# EAGLE design 21-de-77 (EAGLE 6.6.0)
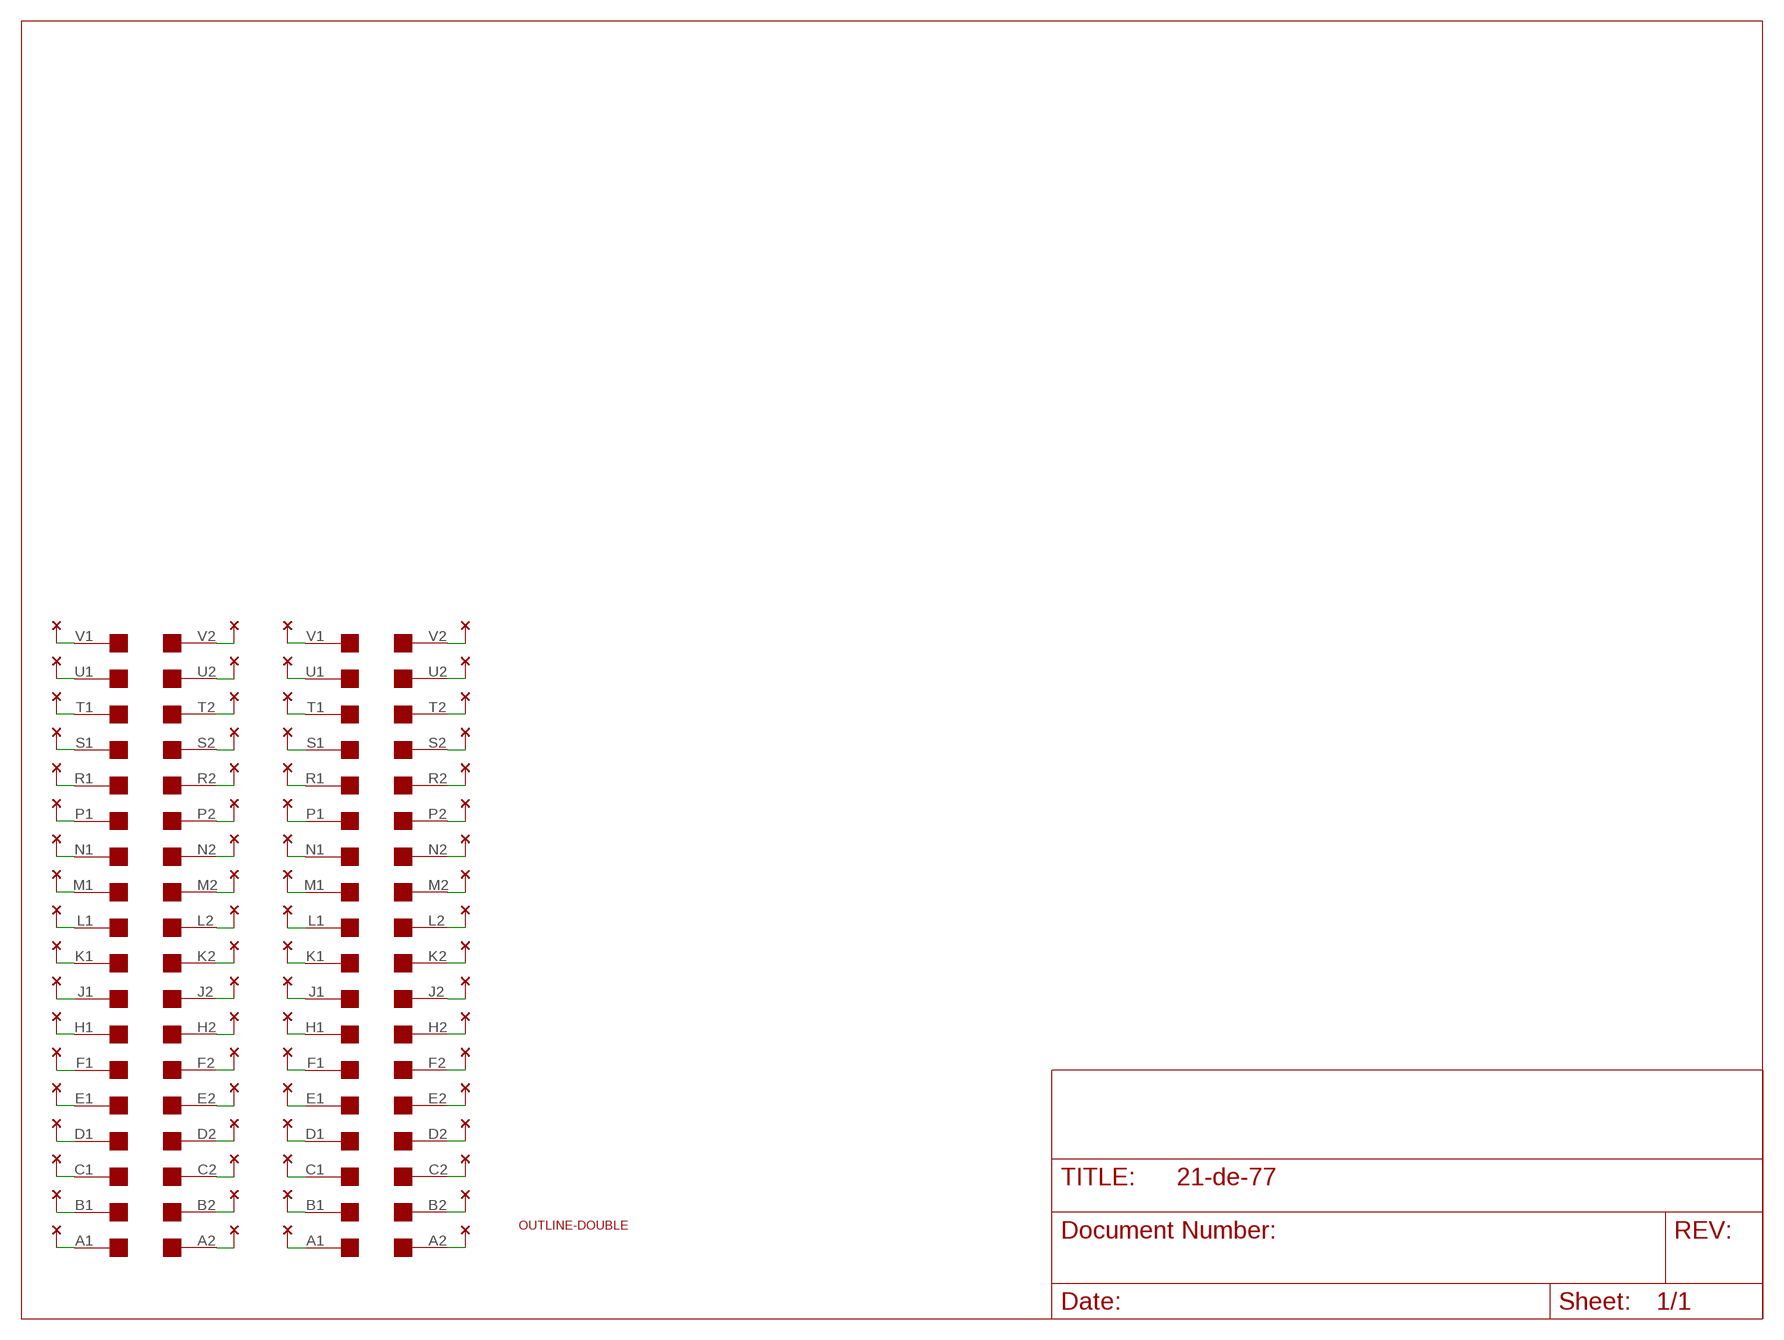
[diagram p0: schematic, sheet 1]

## Parts
U$1  SINGLE  [EDGE-CON2]
U$3  THRU-HOLE2C  [THRU-HOLEC]
U$4  OUTLINE-DOUBLE  [DOUBLE]
U$5  THRU-HOLE2C  [THRU-HOLEC]
U$6  SINGLE  [EDGE-CON2]

## Nets
N$1: U$1.L2 U$3.L2
N$2: U$1.M2 U$3.M2
N$3: U$1.N2 U$3.N2
N$4: U$1.K2 U$3.K2
N$5: U$1.J2 U$3.J2
N$6: U$1.H2 U$3.H2
N$7: U$1.F2 U$3.F2
N$8: U$1.P2 U$3.P2
N$9: U$1.R2 U$3.R2
N$10: U$1.S2 U$3.S2
N$11: U$1.T2 U$3.T2
N$12: U$1.E2 U$3.E2
N$13: U$1.D2 U$3.D2
N$14: U$1.U2 U$3.U2
N$15: U$1.V2 U$3.V2
N$16: U$1.C2 U$3.C2
N$17: U$1.B2 U$3.B2
N$18: U$1.A2 U$3.A2
N$19: U$1.V1 U$3.V1
N$20: U$1.A1 U$3.A1
N$21: U$1.B1 U$3.B1
N$22: U$1.C1 U$3.C1
N$23: U$1.D1 U$3.D1
N$24: U$1.E1 U$3.E1
N$25: U$1.F1 U$3.F1
N$26: U$1.H1 U$3.H1
N$27: U$1.J1 U$3.J1
N$28: U$1.K1 U$3.K1
N$29: U$1.L1 U$3.L1
N$30: U$1.M1 U$3.M1
N$31: U$1.N1 U$3.N1
N$32: U$1.P1 U$3.P1
N$33: U$1.R1 U$3.R1
N$34: U$1.S1 U$3.S1
N$35: U$1.T1 U$3.T1
N$36: U$1.U1 U$3.U1
N$37: U$5.L2 U$6.L2
N$38: U$5.M2 U$6.M2
N$39: U$5.N2 U$6.N2
N$40: U$5.K2 U$6.K2
N$41: U$5.J2 U$6.J2
N$42: U$5.H2 U$6.H2
N$43: U$5.F2 U$6.F2
N$44: U$5.P2 U$6.P2
N$45: U$5.R2 U$6.R2
N$46: U$5.S2 U$6.S2
N$47: U$5.T2 U$6.T2
N$48: U$5.E2 U$6.E2
N$49: U$5.D2 U$6.D2
N$50: U$5.U2 U$6.U2
N$51: U$5.V2 U$6.V2
N$52: U$5.C2 U$6.C2
N$53: U$5.B2 U$6.B2
N$54: U$5.A2 U$6.A2
N$55: U$5.V1 U$6.V1
N$56: U$5.A1 U$6.A1
N$57: U$5.B1 U$6.B1
N$58: U$5.C1 U$6.C1
N$59: U$5.D1 U$6.D1
N$60: U$5.E1 U$6.E1
N$61: U$5.F1 U$6.F1
N$62: U$5.H1 U$6.H1
N$63: U$5.J1 U$6.J1
N$64: U$5.K1 U$6.K1
N$65: U$5.L1 U$6.L1
N$66: U$5.M1 U$6.M1
N$67: U$5.N1 U$6.N1
N$68: U$5.P1 U$6.P1
N$69: U$5.R1 U$6.R1
N$70: U$5.S1 U$6.S1
N$71: U$5.T1 U$6.T1
N$72: U$5.U1 U$6.U1

## Library data of the parts
U$1 U$6 = dec-con:SINGLE: Single-Height DEC board
U$3 U$5 = dec-con:THRU-HOLE2: Thru-Hole addition to double-sided edge connector.
U$4 = dec-con:OUTLINE-*: Board outlines for DEC boards.

## Net classes
0 default: width 1.143 mm

## Board
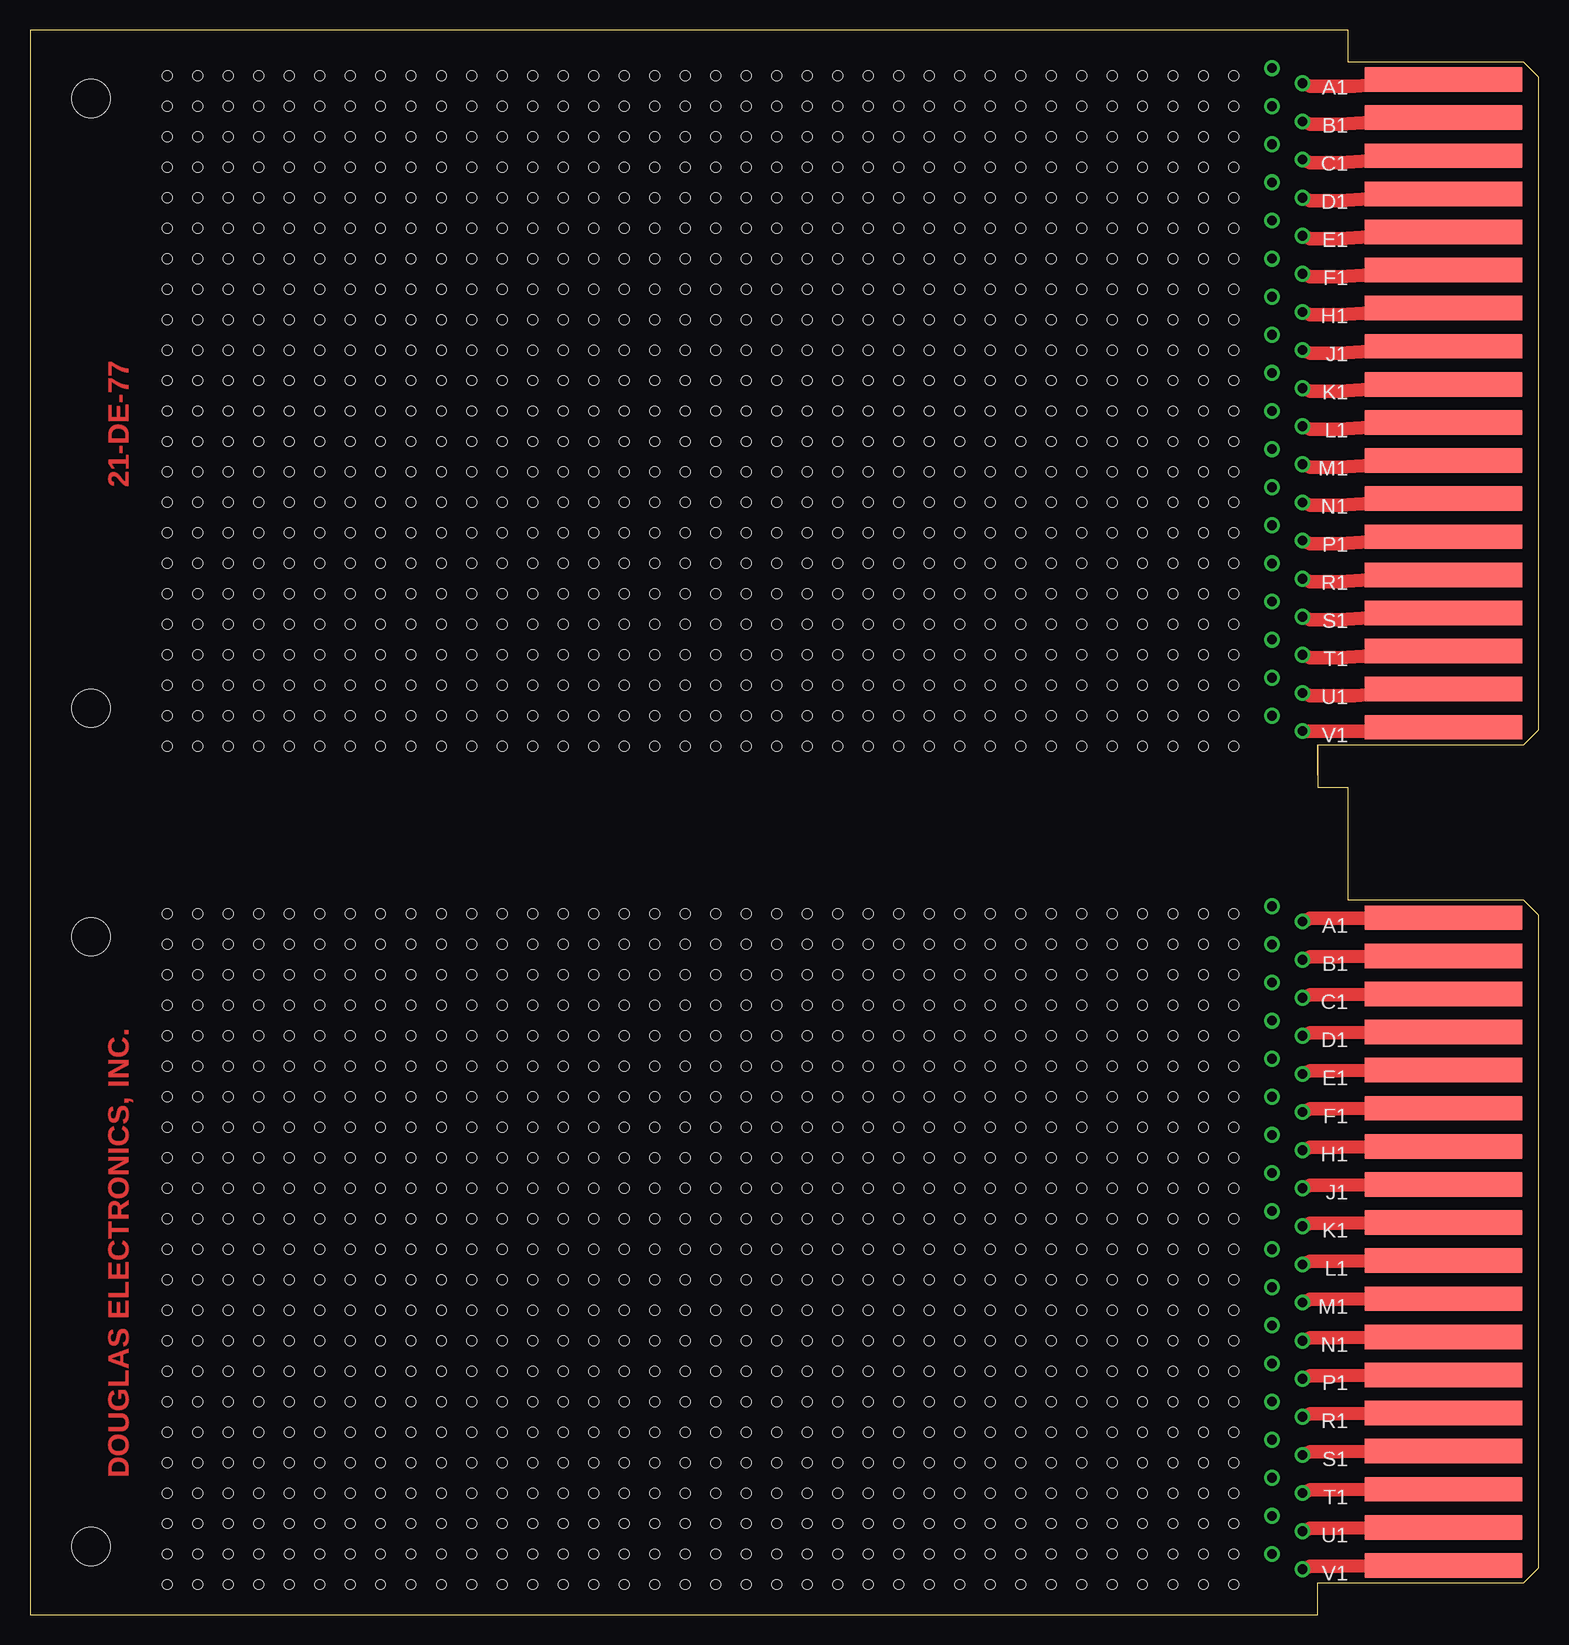
[diagram p1: board, top side]
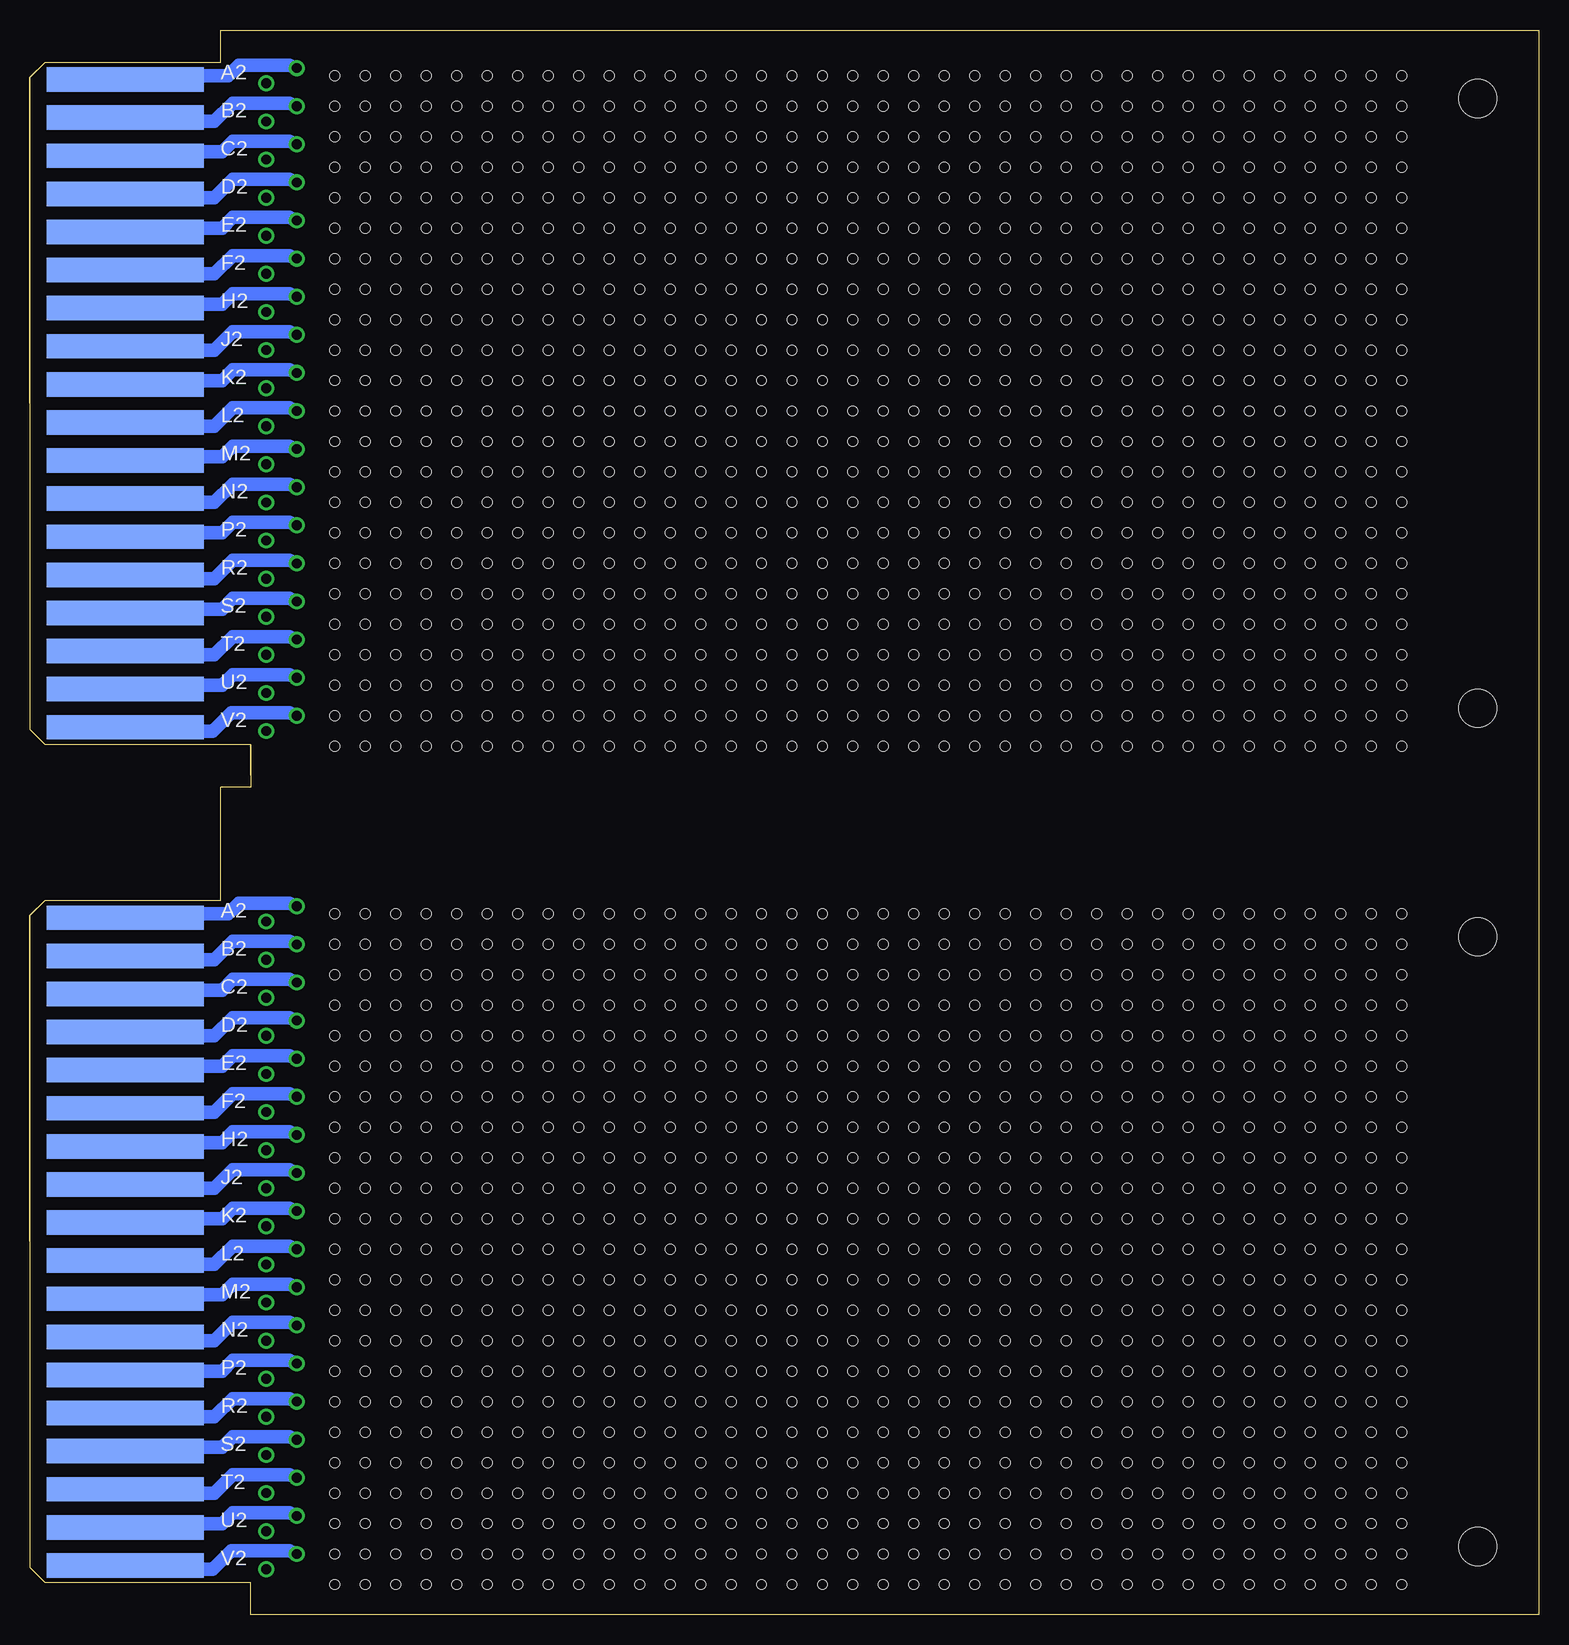
[diagram p2: board, bottom side, seen from below]

Size 125.73 x 132.08 mm. Coordinates in mm from the lower left corner, seen from the top.
Copper layers (1+16): Top 0.035mm / dielectric 1.5mm / Bottom 0.035mm
Design rules "16mils": minimum track width 16mil, minimum drill 32mil, track to track 15mil, track to pad 10mil, pad to pad 10mil, via to via 10mil, smd to smd 10mil, copper to edge 13mil, drill to drill 10mil, minimum pad ring 10mil, minimum via ring 8mil, stop-mask expansion 0mil, vias tented up to drill 0mil, thermal gap 10mil
Holes 0.81 mm at 11.43,58.42 11.43,55.88 11.43,53.34 11.43,50.8 11.43,48.26 11.43,45.72 11.43,43.18 11.43,40.64 11.43,38.1 11.43,35.56 11.43,33.02 11.43,30.48 11.43,27.94 11.43,25.4 11.43,22.86 11.43,20.32 11.43,17.78 11.43,15.24 11.43,12.7 11.43,10.16 11.43,7.62 11.43,5.08 11.43,2.54 13.97,58.42 13.97,55.88 13.97,53.34 13.97,50.8 13.97,48.26 13.97,45.72 13.97,43.18 13.97,40.64 13.97,38.1 13.97,35.56 13.97,33.02 13.97,30.48 13.97,27.94 13.97,25.4 13.97,22.86 13.97,20.32 13.97,17.78 13.97,15.24 13.97,12.7 13.97,10.16 13.97,7.62 13.97,5.08 13.97,2.54 16.51,58.42 16.51,55.88 16.51,53.34 16.51,50.8 16.51,48.26 16.51,45.72 16.51,43.18 16.51,40.64 16.51,38.1 16.51,35.56 16.51,33.02 16.51,30.48 16.51,27.94 16.51,25.4 16.51,22.86 16.51,20.32 16.51,17.78 16.51,15.24 16.51,12.7 16.51,10.16 16.51,7.62 16.51,5.08 16.51,2.54 19.05,58.42 19.05,55.88 19.05,53.34 19.05,50.8 19.05,48.26 19.05,45.72 19.05,43.18 19.05,40.64 19.05,38.1 19.05,35.56 19.05,33.02 19.05,30.48 19.05,27.94 19.05,25.4 19.05,22.86 19.05,20.32 19.05,17.78 19.05,15.24 19.05,12.7 19.05,10.16 19.05,7.62 19.05,5.08 19.05,2.54 21.59,58.42 21.59,55.88 21.59,53.34 21.59,50.8 21.59,48.26 21.59,45.72 21.59,43.18 21.59,40.64 21.59,38.1 21.59,35.56 21.59,33.02 21.59,30.48 21.59,27.94 21.59,25.4 21.59,22.86 21.59,20.32 21.59,17.78 21.59,15.24 21.59,12.7 21.59,10.16 21.59,7.62 21.59,5.08 21.59,2.54 24.13,58.42 24.13,55.88 24.13,53.34 24.13,50.8 24.13,48.26 24.13,45.72 24.13,43.18 24.13,40.64 24.13,38.1 24.13,35.56 24.13,33.02 24.13,30.48 24.13,27.94 24.13,25.4 24.13,22.86 24.13,20.32 24.13,17.78 24.13,15.24 24.13,12.7 24.13,10.16 24.13,7.62 24.13,5.08 24.13,2.54 26.67,58.42 26.67,55.88 26.67,53.34 26.67,50.8 26.67,48.26 26.67,45.72 26.67,43.18 26.67,40.64 26.67,38.1 26.67,35.56 26.67,33.02 26.67,30.48 26.67,27.94 26.67,25.4 26.67,22.86 26.67,20.32 26.67,17.78 26.67,15.24 26.67,12.7 26.67,10.16 26.67,7.62 26.67,5.08 26.67,2.54 29.21,58.42 29.21,55.88 29.21,53.34 29.21,50.8 29.21,48.26 29.21,45.72 29.21,43.18 29.21,40.64 29.21,38.1 29.21,35.56 29.21,33.02 29.21,30.48 29.21,27.94 29.21,25.4 29.21,22.86 29.21,20.32 29.21,17.78 29.21,15.24 29.21,12.7 29.21,10.16 29.21,7.62 29.21,5.08 29.21,2.54 31.75,58.42 31.75,55.88 31.75,53.34 31.75,50.8 31.75,48.26 31.75,45.72 31.75,43.18 31.75,40.64 31.75,38.1 31.75,35.56 31.75,33.02 31.75,30.48 31.75,27.94 31.75,25.4 31.75,22.86 31.75,20.32 31.75,17.78 31.75,15.24 31.75,12.7 31.75,10.16 31.75,7.62 31.75,5.08 31.75,2.54 34.29,58.42 34.29,55.88 34.29,53.34 34.29,50.8 34.29,48.26 34.29,45.72 34.29,43.18 34.29,40.64 34.29,38.1 34.29,35.56 34.29,33.02 34.29,30.48 34.29,27.94 34.29,25.4 34.29,22.86 34.29,20.32 34.29,17.78 34.29,15.24 34.29,12.7 34.29,10.16 34.29,7.62 34.29,5.08 34.29,2.54 36.83,58.42 36.83,55.88 36.83,53.34 36.83,50.8 36.83,48.26 36.83,45.72 36.83,43.18 36.83,40.64 36.83,38.1 36.83,35.56 36.83,33.02 36.83,30.48 36.83,27.94 36.83,25.4 36.83,22.86 36.83,20.32 36.83,17.78 36.83,15.24 36.83,12.7 36.83,10.16 36.83,7.62 36.83,5.08 36.83,2.54 39.37,58.42 39.37,55.88 39.37,53.34 39.37,50.8 39.37,48.26 39.37,45.72 39.37,43.18 39.37,40.64 39.37,38.1 39.37,35.56 39.37,33.02 39.37,30.48 39.37,27.94 39.37,25.4 39.37,22.86 39.37,20.32 39.37,17.78 39.37,15.24 39.37,12.7 39.37,10.16 39.37,7.62 39.37,5.08 39.37,2.54 41.91,58.42 41.91,55.88 41.91,53.34 41.91,50.8 41.91,48.26 41.91,45.72 41.91,43.18 41.91,40.64 41.91,38.1 41.91,35.56 41.91,33.02 41.91,30.48 41.91,27.94 41.91,25.4 41.91,22.86 41.91,20.32 41.91,17.78 41.91,15.24 41.91,12.7 41.91,10.16 41.91,7.62 41.91,5.08 41.91,2.54 44.45,58.42 44.45,55.88 44.45,53.34 44.45,50.8 44.45,48.26 44.45,45.72 44.45,43.18 44.45,40.64 44.45,38.1 44.45,35.56 44.45,33.02 44.45,30.48 44.45,27.94 44.45,25.4 44.45,22.86 44.45,20.32 44.45,17.78 44.45,15.24 44.45,12.7 44.45,10.16 44.45,7.62 44.45,5.08 44.45,2.54 46.99,58.42 46.99,55.88 46.99,53.34 46.99,50.8 46.99,48.26 46.99,45.72 46.99,43.18 46.99,40.64 46.99,38.1 46.99,35.56 46.99,33.02 46.99,30.48 46.99,27.94 46.99,25.4 46.99,22.86 46.99,20.32 46.99,17.78 46.99,15.24 46.99,12.7 46.99,10.16 46.99,7.62 46.99,5.08 46.99,2.54 49.53,58.42 49.53,55.88 49.53,53.34 49.53,50.8 49.53,48.26 49.53,45.72 49.53,43.18 49.53,40.64 49.53,38.1 49.53,35.56 49.53,33.02 49.53,30.48 49.53,27.94 49.53,25.4 49.53,22.86 49.53,20.32 49.53,17.78 49.53,15.24 49.53,12.7 49.53,10.16 49.53,7.62 49.53,5.08 49.53,2.54 52.07,58.42 52.07,55.88 52.07,53.34 52.07,50.8 52.07,48.26 52.07,45.72 52.07,43.18 52.07,40.64 52.07,38.1 52.07,35.56 52.07,33.02 52.07,30.48 52.07,27.94 52.07,25.4 52.07,22.86 52.07,20.32 52.07,17.78 52.07,15.24 52.07,12.7 52.07,10.16 52.07,7.62 52.07,5.08 52.07,2.54 54.61,58.42 54.61,55.88 54.61,53.34 54.61,50.8 54.61,48.26 54.61,45.72 54.61,43.18 54.61,40.64 54.61,38.1 54.61,35.56 54.61,33.02 54.61,30.48 54.61,27.94 54.61,25.4 54.61,22.86 54.61,20.32 54.61,17.78 54.61,15.24 54.61,12.7 54.61,10.16 54.61,7.62 54.61,5.08 54.61,2.54 57.15,58.42 57.15,55.88 57.15,53.34 57.15,50.8 57.15,48.26 57.15,45.72 57.15,43.18 57.15,40.64 57.15,38.1 57.15,35.56 57.15,33.02 57.15,30.48 57.15,27.94 57.15,25.4 57.15,22.86 57.15,20.32 57.15,17.78 57.15,15.24 57.15,12.7 57.15,10.16 57.15,7.62 57.15,5.08 57.15,2.54 59.69,58.42 59.69,55.88 59.69,53.34 59.69,50.8 59.69,48.26 59.69,45.72 59.69,43.18 59.69,40.64 59.69,38.1 59.69,35.56 59.69,33.02 59.69,30.48 59.69,27.94 59.69,25.4 59.69,22.86 59.69,20.32 59.69,17.78 59.69,15.24 59.69,12.7 59.69,10.16 59.69,7.62 59.69,5.08 59.69,2.54 62.23,58.42 62.23,55.88 62.23,53.34 62.23,50.8 62.23,48.26 62.23,45.72 62.23,43.18 62.23,40.64 62.23,38.1 62.23,35.56 62.23,33.02 62.23,30.48 62.23,27.94 62.23,25.4 62.23,22.86 62.23,20.32 62.23,17.78 62.23,15.24 62.23,12.7 62.23,10.16 62.23,7.62 62.23,5.08 62.23,2.54 64.77,58.42 64.77,55.88 64.77,53.34 64.77,50.8 64.77,48.26 64.77,45.72 64.77,43.18 64.77,40.64 64.77,38.1 64.77,35.56 64.77,33.02 64.77,30.48 64.77,27.94 64.77,25.4 64.77,22.86 64.77,20.32 64.77,17.78 64.77,15.24 64.77,12.7 64.77,10.16 64.77,7.62 64.77,5.08 64.77,2.54 67.31,58.42 67.31,55.88 67.31,53.34 67.31,50.8 67.31,48.26 67.31,45.72 67.31,43.18 67.31,40.64 67.31,38.1 67.31,35.56 67.31,33.02 67.31,30.48 67.31,27.94 67.31,25.4 67.31,22.86 67.31,20.32 67.31,17.78 67.31,15.24 67.31,12.7 67.31,10.16 67.31,7.62 67.31,5.08 67.31,2.54 69.85,58.42 69.85,55.88 69.85,53.34 69.85,50.8 69.85,48.26 69.85,45.72 69.85,43.18 69.85,40.64 69.85,38.1 69.85,35.56 69.85,33.02 69.85,30.48 69.85,27.94 69.85,25.4 69.85,22.86 69.85,20.32 69.85,17.78 69.85,15.24 69.85,12.7 69.85,10.16 69.85,7.62 69.85,5.08 69.85,2.54 72.39,58.42 72.39,55.88 72.39,53.34 72.39,50.8 72.39,48.26 72.39,45.72 72.39,43.18 72.39,40.64 72.39,38.1 72.39,35.56 72.39,33.02 72.39,30.48 72.39,27.94 72.39,25.4 72.39,22.86 72.39,20.32 72.39,17.78 72.39,15.24 72.39,12.7 72.39,10.16 72.39,7.62 72.39,5.08 72.39,2.54 74.93,58.42 74.93,55.88 74.93,53.34 74.93,50.8 74.93,48.26 74.93,45.72 74.93,43.18 74.93,40.64 74.93,38.1 74.93,35.56 74.93,33.02 74.93,30.48 74.93,27.94 74.93,25.4 74.93,22.86 74.93,20.32 74.93,17.78 74.93,15.24 74.93,12.7 74.93,10.16 74.93,7.62 74.93,5.08 74.93,2.54 77.47,58.42 77.47,55.88 77.47,53.34 77.47,50.8 77.47,48.26 77.47,45.72 77.47,43.18 77.47,40.64 77.47,38.1 77.47,35.56 77.47,33.02 77.47,30.48 77.47,27.94 77.47,25.4 77.47,22.86 77.47,20.32 77.47,17.78 77.47,15.24 77.47,12.7 77.47,10.16 77.47,7.62 77.47,5.08 77.47,2.54 80.01,58.42 80.01,55.88 80.01,53.34 80.01,50.8 80.01,48.26 80.01,45.72 80.01,43.18 80.01,40.64 80.01,38.1 80.01,35.56 80.01,33.02 80.01,30.48 80.01,27.94 80.01,25.4 80.01,22.86 80.01,20.32 80.01,17.78 80.01,15.24 80.01,12.7 80.01,10.16 80.01,7.62 80.01,5.08 80.01,2.54 82.55,58.42 82.55,55.88 82.55,53.34 82.55,50.8 82.55,48.26 82.55,45.72 82.55,43.18 82.55,40.64 82.55,38.1 82.55,35.56 82.55,33.02 82.55,30.48 82.55,27.94 82.55,25.4 82.55,22.86 82.55,20.32 82.55,17.78 82.55,15.24 82.55,12.7 82.55,10.16 82.55,7.62 82.55,5.08 82.55,2.54 85.09,58.42 85.09,55.88 85.09,53.34 85.09,50.8 85.09,48.26 85.09,45.72 85.09,43.18 85.09,40.64 85.09,38.1 85.09,35.56 85.09,33.02 85.09,30.48 85.09,27.94 85.09,25.4 85.09,22.86 85.09,20.32 85.09,17.78 85.09,15.24 85.09,12.7 85.09,10.16 85.09,7.62 85.09,5.08 85.09,2.54 87.63,58.42 87.63,55.88 87.63,53.34 87.63,50.8 87.63,48.26 87.63,45.72 87.63,43.18 87.63,40.64 87.63,38.1 87.63,35.56 87.63,33.02 87.63,30.48 87.63,27.94 87.63,25.4 87.63,22.86 87.63,20.32 87.63,17.78 87.63,15.24 87.63,12.7 87.63,10.16 87.63,7.62 87.63,5.08 87.63,2.54 90.17,58.42 90.17,55.88 90.17,53.34 90.17,50.8 90.17,48.26 90.17,45.72 90.17,43.18 90.17,40.64 90.17,38.1 90.17,35.56 90.17,33.02 90.17,30.48 90.17,27.94 90.17,25.4 90.17,22.86 90.17,20.32 90.17,17.78 90.17,15.24 90.17,12.7 90.17,10.16 90.17,7.62 90.17,5.08 90.17,2.54 92.71,58.42 92.71,55.88 92.71,53.34 92.71,50.8 92.71,48.26 92.71,45.72 92.71,43.18 92.71,40.64 92.71,38.1 92.71,35.56 92.71,33.02 92.71,30.48 92.71,27.94 92.71,25.4 92.71,22.86 92.71,20.32 92.71,17.78 92.71,15.24 92.71,12.7 92.71,10.16 92.71,7.62 92.71,5.08 92.71,2.54 95.25,58.42 95.25,55.88 95.25,53.34 95.25,50.8 95.25,48.26 95.25,45.72 95.25,43.18 95.25,40.64 95.25,38.1 95.25,35.56 95.25,33.02 95.25,30.48 95.25,27.94 95.25,25.4 95.25,22.86 95.25,20.32 95.25,17.78 95.25,15.24 95.25,12.7 95.25,10.16 95.25,7.62 95.25,5.08 95.25,2.54 97.79,58.42 97.79,55.88 97.79,53.34 97.79,50.8 97.79,48.26 97.79,45.72 97.79,43.18 97.79,40.64 97.79,38.1 97.79,35.56 97.79,33.02 97.79,30.48 97.79,27.94 97.79,25.4 97.79,22.86 97.79,20.32 97.79,17.78 97.79,15.24 97.79,12.7 97.79,10.16 97.79,7.62 97.79,5.08 97.79,2.54 100.33,58.42 100.33,55.88 100.33,53.34 100.33,50.8 100.33,48.26 100.33,45.72 100.33,43.18 100.33,40.64 100.33,38.1 100.33,35.56 100.33,33.02 100.33,30.48 100.33,27.94 100.33,25.4 100.33,22.86 100.33,20.32 100.33,17.78 100.33,15.24 100.33,12.7 100.33,10.16 100.33,7.62 100.33,5.08 100.33,2.54 11.43,128.27 11.43,125.73 11.43,123.19 11.43,120.65 11.43,118.11 11.43,115.57 11.43,113.03 11.43,110.49 11.43,107.95 11.43,105.41 11.43,102.87 11.43,100.33 11.43,97.79 11.43,95.25 11.43,92.71 11.43,90.17 11.43,87.63 11.43,85.09 11.43,82.55 11.43,80.01 11.43,77.47 11.43,74.93 11.43,72.39 13.97,128.27 13.97,125.73 13.97,123.19 13.97,120.65 13.97,118.11 13.97,115.57 13.97,113.03 13.97,110.49 13.97,107.95 13.97,105.41 13.97,102.87 13.97,100.33 13.97,97.79 13.97,95.25 13.97,92.71 13.97,90.17 13.97,87.63 13.97,85.09 13.97,82.55 13.97,80.01 13.97,77.47 13.97,74.93 13.97,72.39 16.51,128.27 16.51,125.73 16.51,123.19 16.51,120.65 16.51,118.11 16.51,115.57 16.51,113.03 16.51,110.49 16.51,107.95 16.51,105.41 16.51,102.87 16.51,100.33 16.51,97.79 16.51,95.25 16.51,92.71 16.51,90.17 16.51,87.63 16.51,85.09 16.51,82.55 16.51,80.01 16.51,77.47 16.51,74.93 16.51,72.39 19.05,128.27 19.05,125.73 19.05,123.19 19.05,120.65 19.05,118.11 19.05,115.57 19.05,113.03 19.05,110.49 19.05,107.95 19.05,105.41 19.05,102.87 19.05,100.33 19.05,97.79 19.05,95.25 19.05,92.71 19.05,90.17 19.05,87.63 19.05,85.09 19.05,82.55 19.05,80.01 19.05,77.47 19.05,74.93 19.05,72.39 21.59,128.27 21.59,125.73 21.59,123.19 21.59,120.65 21.59,118.11 21.59,115.57 21.59,113.03 21.59,110.49 21.59,107.95 21.59,105.41 21.59,102.87 21.59,100.33 21.59,97.79 21.59,95.25 21.59,92.71 21.59,90.17 21.59,87.63 21.59,85.09 21.59,82.55 21.59,80.01 21.59,77.47 21.59,74.93 21.59,72.39 24.13,128.27 24.13,125.73 24.13,123.19 24.13,120.65 24.13,118.11 24.13,115.57 24.13,113.03 24.13,110.49 24.13,107.95 24.13,105.41 24.13,102.87 24.13,100.33 24.13,97.79 24.13,95.25 24.13,92.71 24.13,90.17 24.13,87.63 24.13,85.09 24.13,82.55 24.13,80.01 24.13,77.47 24.13,74.93 24.13,72.39 26.67,128.27 26.67,125.73 26.67,123.19 26.67,120.65 26.67,118.11 26.67,115.57 26.67,113.03 26.67,110.49 26.67,107.95 26.67,105.41 26.67,102.87 26.67,100.33 26.67,97.79 26.67,95.25 26.67,92.71 26.67,90.17 26.67,87.63 26.67,85.09 26.67,82.55 26.67,80.01 26.67,77.47 26.67,74.93 26.67,72.39 29.21,128.27 29.21,125.73 29.21,123.19 29.21,120.65 29.21,118.11 29.21,115.57 29.21,113.03 29.21,110.49 29.21,107.95 29.21,105.41 29.21,102.87 29.21,100.33 29.21,97.79 29.21,95.25 29.21,92.71 29.21,90.17 29.21,87.63 29.21,85.09 29.21,82.55 29.21,80.01 29.21,77.47 29.21,74.93 29.21,72.39 31.75,128.27 31.75,125.73 31.75,123.19 31.75,120.65 31.75,118.11 31.75,115.57 31.75,113.03 31.75,110.49 31.75,107.95 31.75,105.41 31.75,102.87 31.75,100.33 31.75,97.79 31.75,95.25 31.75,92.71 31.75,90.17 31.75,87.63 31.75,85.09 31.75,82.55 31.75,80.01 31.75,77.47 31.75,74.93 31.75,72.39 34.29,128.27 34.29,125.73 34.29,123.19 34.29,120.65 34.29,118.11 34.29,115.57 34.29,113.03 34.29,110.49 34.29,107.95 34.29,105.41 34.29,102.87 34.29,100.33 34.29,97.79 34.29,95.25 34.29,92.71 34.29,90.17 34.29,87.63 34.29,85.09 34.29,82.55 34.29,80.01 34.29,77.47 34.29,74.93 34.29,72.39 36.83,128.27 36.83,125.73 36.83,123.19 36.83,120.65 36.83,118.11 36.83,115.57 36.83,113.03 36.83,110.49 36.83,107.95 36.83,105.41 36.83,102.87 36.83,100.33 36.83,97.79 36.83,95.25 36.83,92.71 36.83,90.17 36.83,87.63 36.83,85.09 36.83,82.55 36.83,80.01 36.83,77.47 36.83,74.93 36.83,72.39 39.37,128.27 39.37,125.73 39.37,123.19 39.37,120.65 39.37,118.11 39.37,115.57 39.37,113.03 39.37,110.49 39.37,107.95 39.37,105.41 39.37,102.87 39.37,100.33 39.37,97.79 39.37,95.25 39.37,92.71 39.37,90.17 39.37,87.63 39.37,85.09 39.37,82.55 39.37,80.01 39.37,77.47 39.37,74.93 39.37,72.39 41.91,128.27 41.91,125.73 41.91,123.19 41.91,120.65 41.91,118.11 41.91,115.57 41.91,113.03 41.91,110.49 41.91,107.95 41.91,105.41 41.91,102.87 41.91,100.33 41.91,97.79 41.91,95.25 41.91,92.71 41.91,90.17 41.91,87.63 41.91,85.09 41.91,82.55 41.91,80.01 41.91,77.47 41.91,74.93 41.91,72.39 44.45,128.27 44.45,125.73 44.45,123.19 44.45,120.65 44.45,118.11 44.45,115.57 44.45,113.03 44.45,110.49 44.45,107.95 44.45,105.41 44.45,102.87 44.45,100.33 44.45,97.79 44.45,95.25 44.45,92.71 44.45,90.17 44.45,87.63 44.45,85.09 44.45,82.55 44.45,80.01 44.45,77.47 44.45,74.93 44.45,72.39 46.99,128.27 46.99,125.73 46.99,123.19 46.99,120.65 46.99,118.11 46.99,115.57 46.99,113.03 46.99,110.49 46.99,107.95 46.99,105.41 46.99,102.87 46.99,100.33 46.99,97.79 46.99,95.25 46.99,92.71 46.99,90.17 46.99,87.63 46.99,85.09 46.99,82.55 46.99,80.01 46.99,77.47 46.99,74.93 46.99,72.39 49.53,128.27 49.53,125.73 49.53,123.19 49.53,120.65 49.53,118.11 49.53,115.57 49.53,113.03 49.53,110.49 49.53,107.95 49.53,105.41 49.53,102.87 49.53,100.33 49.53,97.79 49.53,95.25 49.53,92.71 49.53,90.17 49.53,87.63 49.53,85.09 49.53,82.55 49.53,80.01 49.53,77.47 49.53,74.93 49.53,72.39 52.07,128.27 52.07,125.73 52.07,123.19 52.07,120.65 52.07,118.11 52.07,115.57 52.07,113.03 52.07,110.49 52.07,107.95 52.07,105.41 52.07,102.87 52.07,100.33 52.07,97.79 52.07,95.25 52.07,92.71 52.07,90.17 52.07,87.63 52.07,85.09 52.07,82.55 52.07,80.01 52.07,77.47 52.07,74.93 52.07,72.39 54.61,128.27 54.61,125.73 54.61,123.19 54.61,120.65 54.61,118.11 54.61,115.57 54.61,113.03 54.61,110.49 54.61,107.95 54.61,105.41 54.61,102.87 54.61,100.33 54.61,97.79 54.61,95.25 54.61,92.71 54.61,90.17 54.61,87.63 54.61,85.09 54.61,82.55 54.61,80.01 54.61,77.47 54.61,74.93 54.61,72.39 57.15,128.27 57.15,125.73 57.15,123.19 57.15,120.65 57.15,118.11 57.15,115.57 57.15,113.03 57.15,110.49 57.15,107.95 57.15,105.41 57.15,102.87 57.15,100.33 57.15,97.79 57.15,95.25 57.15,92.71 57.15,90.17 57.15,87.63 57.15,85.09 57.15,82.55 57.15,80.01 57.15,77.47 57.15,74.93 57.15,72.39 59.69,128.27 59.69,125.73 59.69,123.19 59.69,120.65 59.69,118.11 59.69,115.57 59.69,113.03 59.69,110.49 59.69,107.95 59.69,105.41 59.69,102.87 59.69,100.33 59.69,97.79 59.69,95.25 59.69,92.71 59.69,90.17 59.69,87.63 59.69,85.09 59.69,82.55 59.69,80.01 59.69,77.47 59.69,74.93 59.69,72.39 62.23,128.27 62.23,125.73 62.23,123.19 62.23,120.65 62.23,118.11 62.23,115.57 62.23,113.03 62.23,110.49 62.23,107.95 62.23,105.41 62.23,102.87 62.23,100.33 62.23,97.79 62.23,95.25 62.23,92.71 62.23,90.17 62.23,87.63 62.23,85.09 62.23,82.55 62.23,80.01 62.23,77.47 62.23,74.93 62.23,72.39 64.77,128.27 64.77,125.73 64.77,123.19 64.77,120.65 64.77,118.11 64.77,115.57 64.77,113.03 64.77,110.49 64.77,107.95 64.77,105.41 64.77,102.87 64.77,100.33 64.77,97.79 64.77,95.25 64.77,92.71 64.77,90.17 64.77,87.63 64.77,85.09 64.77,82.55 64.77,80.01 64.77,77.47 64.77,74.93 64.77,72.39 67.31,128.27 67.31,125.73 67.31,123.19 67.31,120.65 67.31,118.11 67.31,115.57 67.31,113.03 67.31,110.49 67.31,107.95 67.31,105.41 67.31,102.87 67.31,100.33 67.31,97.79 67.31,95.25 67.31,92.71 67.31,90.17 67.31,87.63 67.31,85.09 67.31,82.55 67.31,80.01 67.31,77.47 67.31,74.93 67.31,72.39 69.85,128.27 69.85,125.73 69.85,123.19 69.85,120.65 69.85,118.11 69.85,115.57 69.85,113.03 69.85,110.49 69.85,107.95 69.85,105.41 69.85,102.87 69.85,100.33 69.85,97.79 69.85,95.25 69.85,92.71 69.85,90.17 69.85,87.63 69.85,85.09 69.85,82.55 69.85,80.01 69.85,77.47 69.85,74.93 69.85,72.39 72.39,128.27 72.39,125.73 72.39,123.19 72.39,120.65 72.39,118.11 72.39,115.57 72.39,113.03 72.39,110.49 72.39,107.95 72.39,105.41 72.39,102.87 72.39,100.33 72.39,97.79 72.39,95.25 72.39,92.71 72.39,90.17 72.39,87.63 72.39,85.09 72.39,82.55 72.39,80.01 72.39,77.47 72.39,74.93 72.39,72.39 74.93,128.27 74.93,125.73 74.93,123.19 74.93,120.65 74.93,118.11 74.93,115.57 74.93,113.03 74.93,110.49 74.93,107.95 74.93,105.41 74.93,102.87 74.93,100.33 74.93,97.79 74.93,95.25 74.93,92.71 74.93,90.17 74.93,87.63 74.93,85.09 74.93,82.55 74.93,80.01 74.93,77.47 74.93,74.93 74.93,72.39 77.47,128.27 77.47,125.73 77.47,123.19 77.47,120.65 77.47,118.11 77.47,115.57 77.47,113.03 77.47,110.49 77.47,107.95 77.47,105.41 77.47,102.87 77.47,100.33 77.47,97.79 77.47,95.25 77.47,92.71 77.47,90.17 77.47,87.63 77.47,85.09 77.47,82.55 77.47,80.01 77.47,77.47 77.47,74.93 77.47,72.39 80.01,128.27 80.01,125.73 80.01,123.19 80.01,120.65 80.01,118.11 80.01,115.57 80.01,113.03 80.01,110.49 80.01,107.95 80.01,105.41 80.01,102.87 80.01,100.33 80.01,97.79 80.01,95.25 80.01,92.71 80.01,90.17 80.01,87.63 80.01,85.09 80.01,82.55 80.01,80.01 80.01,77.47 80.01,74.93 80.01,72.39 82.55,128.27 82.55,125.73 82.55,123.19 82.55,120.65 82.55,118.11 82.55,115.57 82.55,113.03 82.55,110.49 82.55,107.95 82.55,105.41 82.55,102.87 82.55,100.33 82.55,97.79 82.55,95.25 82.55,92.71 82.55,90.17 82.55,87.63 82.55,85.09 82.55,82.55 82.55,80.01 82.55,77.47 82.55,74.93 82.55,72.39 85.09,128.27 85.09,125.73 85.09,123.19 85.09,120.65 85.09,118.11 85.09,115.57 85.09,113.03 85.09,110.49 85.09,107.95 85.09,105.41 85.09,102.87 85.09,100.33 85.09,97.79 85.09,95.25 85.09,92.71 85.09,90.17 85.09,87.63 85.09,85.09 85.09,82.55 85.09,80.01 85.09,77.47 85.09,74.93 85.09,72.39 87.63,128.27 87.63,125.73 87.63,123.19 87.63,120.65 87.63,118.11 87.63,115.57 87.63,113.03 87.63,110.49 87.63,107.95 87.63,105.41 87.63,102.87 87.63,100.33 87.63,97.79 87.63,95.25 87.63,92.71 87.63,90.17 87.63,87.63 87.63,85.09 87.63,82.55 87.63,80.01 87.63,77.47 87.63,74.93 87.63,72.39 90.17,128.27 90.17,125.73 90.17,123.19 90.17,120.65 90.17,118.11 90.17,115.57 90.17,113.03 90.17,110.49 90.17,107.95 90.17,105.41 90.17,102.87 90.17,100.33 90.17,97.79 90.17,95.25 90.17,92.71 90.17,90.17 90.17,87.63 90.17,85.09 90.17,82.55 90.17,80.01 90.17,77.47 90.17,74.93 90.17,72.39 92.71,128.27 92.71,125.73 92.71,123.19 92.71,120.65 92.71,118.11 92.71,115.57 92.71,113.03 92.71,110.49 92.71,107.95 92.71,105.41 92.71,102.87 92.71,100.33 92.71,97.79 92.71,95.25 92.71,92.71 92.71,90.17 92.71,87.63 92.71,85.09 92.71,82.55 92.71,80.01 92.71,77.47 92.71,74.93 92.71,72.39 95.25,128.27 95.25,125.73 95.25,123.19 95.25,120.65 95.25,118.11 95.25,115.57 95.25,113.03 95.25,110.49 95.25,107.95 95.25,105.41 95.25,102.87 95.25,100.33 95.25,97.79 95.25,95.25 95.25,92.71 95.25,90.17 95.25,87.63 95.25,85.09 95.25,82.55 95.25,80.01 95.25,77.47 95.25,74.93 95.25,72.39 97.79,128.27 97.79,125.73 97.79,123.19 97.79,120.65 97.79,118.11 97.79,115.57 97.79,113.03 97.79,110.49 97.79,107.95 97.79,105.41 97.79,102.87 97.79,100.33 97.79,97.79 97.79,95.25 97.79,92.71 97.79,90.17 97.79,87.63 97.79,85.09 97.79,82.55 97.79,80.01 97.79,77.47 97.79,74.93 97.79,72.39 100.33,128.27 100.33,125.73 100.33,123.19 100.33,120.65 100.33,118.11 100.33,115.57 100.33,113.03 100.33,110.49 100.33,107.95 100.33,105.41 100.33,102.87 100.33,100.33 100.33,97.79 100.33,95.25 100.33,92.71 100.33,90.17 100.33,87.63 100.33,85.09 100.33,82.55 100.33,80.01 100.33,77.47 100.33,74.93 100.33,72.39

### Footprints (pad centres in the part's own frame; a part is rotated, then mirrored left to right if it is on the bottom)
EDGE-CON2 = smd 13.106 x 2.032: A1 7.938,4.128; B1 7.938,7.303; C1 7.938,10.477; D1 7.938,13.652; E1 7.938,16.828; F1 7.938,20.003; H1 7.938,23.177; J1 7.938,26.352; K1 7.938,29.527; L1 7.938,32.703; M1 7.938,35.877; N1 7.938,39.053; P1 7.938,42.227; R1 7.938,45.403; S1 7.938,48.578; T1 7.938,51.752; U1 7.938,54.928; V1 7.938,58.102 | smd 13.106 x 2.032 bottom: A2 7.938,4.128; B2 7.938,7.303; C2 7.938,10.477; D2 7.938,13.652; E2 7.938,16.828; F2 7.938,20.003; H2 7.938,23.177; J2 7.938,26.352; K2 7.938,29.527; L2 7.938,32.703; M2 7.938,35.877; N2 7.938,39.053; P2 7.938,42.227; R2 7.938,45.403; S2 7.938,48.578; T2 7.938,51.752; U2 7.938,54.928; V2 7.938,58.102
THRU-HOLEC = drill 0.813 pad 1.27: A1 17.78,3.81; A2 20.32,2.54; B1 17.78,6.985; B2 20.32,5.715; C1 17.78,10.16; C2 20.32,8.89; D1 17.78,13.335; D2 20.32,12.065; E1 17.78,16.51; E2 20.32,15.24; F1 17.78,19.685; F2 20.32,18.415; H1 17.78,22.86; H2 20.32,21.59; J1 17.78,26.035; J2 20.32,24.765; K1 17.78,29.21; K2 20.32,27.94; L1 17.78,32.385; L2 20.32,31.115; M1 17.78,35.56; M2 20.32,34.29; N1 17.78,38.735; N2 20.32,37.465; P1 17.78,41.91; P2 20.32,40.64; R1 17.78,45.085; R2 20.32,43.815; S1 17.78,48.26; S2 20.32,46.99; T1 17.78,51.435; T2 20.32,50.165; U1 17.78,54.61; U2 20.32,53.34; V1 17.78,57.785; V2 20.32,56.515
DOUBLE = hole 3.175: 120.65,56.515; 120.65,5.715; 120.65,75.565; 120.65,126.365

### Placement (x,y rotation side)
U$1  125.73,62.23 180 top
U$3  123.83,61.59 180 top
U$4  125.73,132.08 180 top
U$5  123.83,131.44 180 top
U$6  125.73,132.08 180 top

### Tracks (layer width: path | path; a pad name or v marks a point on that pad's centre or on a via)
N$1
  Bottom 1.143: U$3.L2 104.14,30.73 108.84,30.73 110.36,29.21 111.76,29.21 U$1.L2
N$2
  Bottom 1.143: U$3.M2 104.14,27.56 108.84,27.56 109.73,26.67 111.76,26.67 U$1.M2
N$3
  Bottom 1.143: U$3.N2 104.14,24.38 108.84,24.38 110.36,22.86 111.76,22.86 U$1.N2
N$4
  Bottom 1.143: U$3.K2 104.14,33.91 108.84,33.91 109.73,33.02 111.76,33.02 U$1.K2
N$5
  Bottom 1.143: U$3.J2 104.14,37.08 108.84,37.08 110.36,35.56 111.76,35.56 U$1.J2
N$6
  Bottom 1.143: U$3.H2 104.14,40.26 108.84,40.26 109.73,39.37 111.76,39.37 U$1.H2
N$7
  Bottom 1.143: U$3.F2 104.14,43.43 108.84,43.43 110.36,41.91 111.76,41.91 U$1.F2
N$8
  Bottom 1.143: U$3.P2 104.14,21.21 108.84,21.21 109.73,20.32 111.76,20.32 U$1.P2
N$9
  Bottom 1.143: U$3.R2 104.14,18.03 108.84,18.03 110.36,16.51 111.76,16.51 U$1.R2
N$10
  Bottom 1.143: U$3.S2 104.14,14.86 108.84,14.86 109.73,13.97 111.76,13.97 U$1.S2
N$11
  Bottom 1.143: U$3.T2 104.14,11.68 108.84,11.68 110.36,10.16 111.76,10.16 U$1.T2
N$12
  Bottom 1.143: U$3.E2 104.14,46.61 108.84,46.61 109.73,45.72 111.76,45.72 U$1.E2
N$13
  Bottom 1.143: U$3.D2 104.14,49.78 108.84,49.78 110.36,48.26 111.76,48.26 U$1.D2
N$14
  Bottom 1.143: U$3.U2 104.14,8.51 108.84,8.51 109.73,7.62 111.76,7.62 U$1.U2
N$15
  Bottom 1.143: U$3.V2 104.14,5.33 108.97,5.33 110.49,3.81 111.76,3.81 U$1.V2
N$16
  Bottom 1.143: U$3.C2 104.14,52.96 108.84,52.96 109.73,52.07 111.76,52.07 U$1.C2
N$17
  Bottom 1.143: U$3.B2 104.14,56.13 108.84,56.13 110.36,54.61 111.76,54.61 U$1.B2
N$18
  Bottom 1.143: U$3.A2 104.14,59.31 108.33,59.31 109.22,58.42 111.63,58.42 U$1.A2
N$19
  Top 1.143: U$3.V1 106.68,4.06 109.09,4.06 U$1.V1
N$20
  Top 1.143: U$3.A1 106.68,58.04 111.63,58.04 U$1.A1
N$21
  Top 1.143: U$3.B1 106.68,54.86 109.09,54.86 U$1.B1
N$22
  Top 1.143: U$3.C1 106.68,51.69 109.09,51.69 U$1.C1
N$23
  Top 1.143: U$3.D1 106.68,48.51 109.09,48.51 U$1.D1
N$24
  Top 1.143: U$3.E1 106.68,45.34 109.09,45.34 U$1.E1
N$25
  Top 1.143: U$3.F1 106.68,42.16 109.09,42.16 U$1.F1
N$26
  Top 1.143: U$3.H1 106.68,38.99 109.09,38.99 U$1.H1
N$27
  Top 1.143: U$3.J1 106.68,35.81 109.09,35.81 U$1.J1
N$28
  Top 1.143: U$3.K1 106.68,32.64 109.09,32.64 U$1.K1
N$29
  Top 1.143: U$3.L1 106.68,29.46 109.09,29.46 U$1.L1
N$30
  Top 1.143: U$3.M1 106.68,26.29 109.09,26.29 U$1.M1
N$31
  Top 1.143: U$3.N1 106.68,23.11 109.09,23.11 U$1.N1
N$32
  Top 1.143: U$3.P1 106.68,19.94 109.09,19.94 U$1.P1
N$33
  Top 1.143: U$3.R1 106.68,16.76 109.09,16.76 U$1.R1
N$34
  Top 1.143: U$3.S1 106.68,13.59 109.09,13.59 U$1.S1
N$35
  Top 1.143: U$3.T1 106.68,10.41 109.09,10.41 U$1.T1
N$36
  Top 1.143: U$3.U1 106.68,7.24 109.09,7.24 U$1.U1
N$37
  Bottom 1.143: U$5.L2 104.14,100.58 108.84,100.58 110.36,99.06 111.76,99.06 U$6.L2
N$38
  Bottom 1.143: U$5.M2 104.14,97.41 108.84,97.41 109.73,96.52 111.76,96.52 U$6.M2
N$39
  Bottom 1.143: U$5.N2 104.14,94.23 108.84,94.23 110.36,92.71 111.76,92.71 U$6.N2
N$40
  Bottom 1.143: U$5.K2 104.14,103.76 108.84,103.76 109.73,102.87 111.76,102.87 U$6.K2
N$41
  Bottom 1.143: U$5.J2 104.14,106.93 108.84,106.93 110.36,105.41 111.76,105.41 U$6.J2
N$42
  Bottom 1.143: U$5.H2 104.14,110.11 108.84,110.11 109.73,109.22 111.76,109.22 U$6.H2
N$43
  Bottom 1.143: U$5.F2 104.14,113.28 108.84,113.28 110.36,111.76 111.76,111.76 U$6.F2
N$44
  Bottom 1.143: U$5.P2 104.14,91.06 108.84,91.06 109.73,90.17 111.76,90.17 U$6.P2
N$45
  Bottom 1.143: U$5.R2 104.14,87.88 108.84,87.88 110.36,86.36 111.76,86.36 U$6.R2
N$46
  Bottom 1.143: U$5.S2 104.14,84.71 108.84,84.71 109.73,83.82 111.76,83.82 U$6.S2
N$47
  Bottom 1.143: U$5.T2 104.14,81.53 108.84,81.53 110.36,80.01 111.76,80.01 U$6.T2
N$48
  Bottom 1.143: U$5.E2 104.14,116.46 108.84,116.46 109.73,115.57 111.76,115.57 U$6.E2
N$49
  Bottom 1.143: U$5.D2 104.14,119.63 108.84,119.63 110.36,118.11 111.76,118.11 U$6.D2
N$50
  Bottom 1.143: U$5.U2 104.14,78.36 108.84,78.36 109.73,77.47 111.76,77.47 U$6.U2
N$51
  Bottom 1.143: U$5.V2 104.14,75.18 108.97,75.18 110.49,73.66 111.76,73.66 U$6.V2
N$52
  Bottom 1.143: U$5.C2 104.14,122.81 108.84,122.81 109.73,121.92 111.76,121.92 U$6.C2
N$53
  Bottom 1.143: U$5.B2 104.14,125.98 108.84,125.98 110.36,124.46 111.76,124.46 U$6.B2
N$54
  Bottom 1.143: U$5.A2 104.14,129.16 108.33,129.16 109.22,128.27 111.63,128.27 U$6.A2
N$55
  Top 1.143: U$5.V1 111.63,73.66 U$6.V1
N$56
  Top 1.143: U$5.A1 106.68,127.38 110.36,127.38 U$6.A1
N$57
  Top 1.143: U$5.B1 106.68,124.21 109.09,124.21 U$6.B1
N$58
  Top 1.143: U$5.C1 106.68,121.03 109.09,121.03 U$6.C1
N$59
  Top 1.143: U$5.D1 106.68,117.86 109.09,117.86 U$6.D1
N$60
  Top 1.143: U$5.E1 106.68,114.68 109.09,114.68 U$6.E1
N$61
  Top 1.143: U$5.F1 106.68,111.51 109.09,111.51 U$6.F1
N$62
  Top 1.143: U$5.H1 106.68,108.33 109.09,108.33 U$6.H1
N$63
  Top 1.143: U$5.J1 106.68,105.16 109.09,105.16 U$6.J1
N$64
  Top 1.143: U$5.K1 106.68,101.98 109.09,101.98 U$6.K1
N$65
  Top 1.143: U$5.L1 106.68,98.81 109.09,98.81 U$6.L1
N$66
  Top 1.143: U$5.M1 106.68,95.63 109.09,95.63 U$6.M1
N$67
  Top 1.143: U$5.N1 106.68,92.46 109.09,92.46 U$6.N1
N$68
  Top 1.143: U$5.P1 106.68,89.28 109.09,89.28 U$6.P1
N$69
  Top 1.143: U$5.R1 106.68,86.11 109.09,86.11 U$6.R1
N$70
  Top 1.143: U$5.S1 106.68,82.93 109.09,82.93 U$6.S1
N$71
  Top 1.143: U$5.T1 106.68,79.76 109.09,79.76 U$6.T1
N$72
  Top 1.143: U$5.U1 106.68,76.58 110.36,76.58 U$6.U1

### Text on the board
Top: 21-DE-77 | DOUGLAS ELECTRONICS, INC.